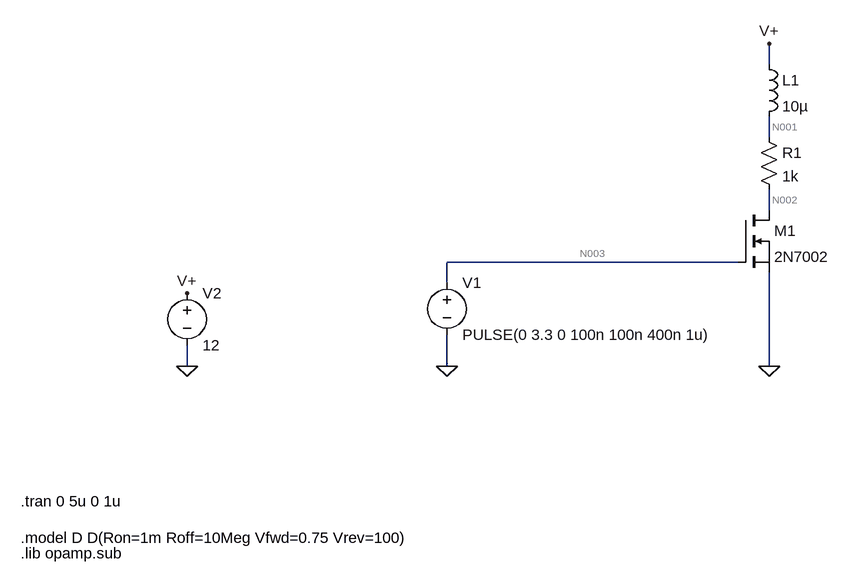
[diagram p0: schematic driver.asc]
driver.asc, the LTspice schematic file:
Version 4
SHEET 1 1320 700
WIRE 128 -128 128 -160
WIRE 128 -16 128 -48
WIRE 128 96 128 64
WIRE 80 176 -368 176
WIRE -368 208 -368 176
WIRE -768 336 -768 304
WIRE -368 336 -368 288
WIRE 128 336 128 192
FLAG -368 336 0
FLAG -768 336 0
FLAG -768 224 V+
FLAG 128 336 0
FLAG 128 -160 V+
SYMBOL voltage -368 192 R0
WINDOW 123 0 0 Left 0
WINDOW 39 0 0 Left 0
SYMATTR InstName V1
SYMATTR Value PULSE(0 3.3 0 100n 100n 400n 1u)
SYMBOL voltage -768 208 R0
WINDOW 123 0 0 Left 0
WINDOW 39 0 0 Left 0
SYMATTR InstName V2
SYMATTR Value 12
SYMBOL nmos 80 96 R0
SYMATTR InstName M1
SYMATTR Value 2N7002
SYMBOL ind 112 -144 R0
SYMATTR InstName L1
SYMATTR Value 10µ
SYMBOL res 112 -32 R0
SYMATTR InstName R1
SYMATTR Value 1k
TEXT -1024 544 Left 2 !.tran 0 5u 0 1u
TEXT -1024 600 Left 2 !.model D D(Ron=1m Roff=10Meg Vfwd=0.75 Vrev=100)
TEXT -1024 624 Left 2 !.lib opamp.sub

The netlist it stands for:
* driver.asc
V1 N003 0 PULSE(0 3.3 0 100n 100n 400n 1u)
V2 V+ 0 12
M1 N002 N003 0 0 2N7002
L1 V+ N001 10µ
R1 N001 N002 1k
.model NMOS NMOS
.model PMOS PMOS
.lib standard.mos
.tran 0 5u 0 1u
.model D D(Ron=1m Roff=10Meg Vfwd=0.75 Vrev=100)
.lib opamp.sub
.backanno
.end

* Results of the author's LTspice run, read from the files saved beside the schematic
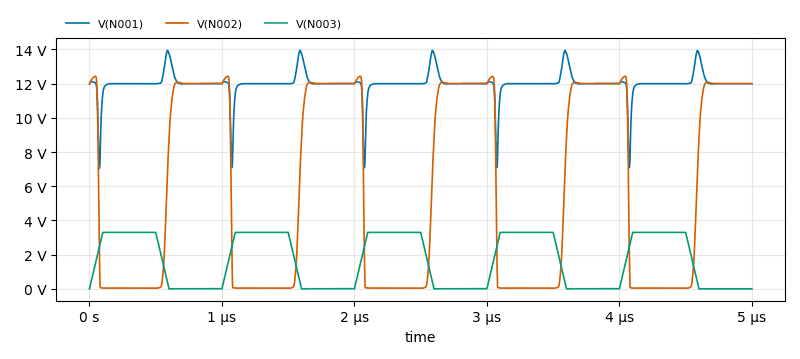
[diagram p1: Transient Analysis of driver.asc, plotted from the saved traces]
* Transient Analysis, 1 run:
*   V(N001): min 7.053 V, max 13.95 V, average 12 V, rms 12.02 V, last 12 V
*   V(N002): min 33.37 mV, max 12.43 V, average 5.822 V, rms 8.216 V, last 12 V
*   V(N003): min 0 V, max 3.3 V, average 1.65 V, rms 2.255 V, last 0 V